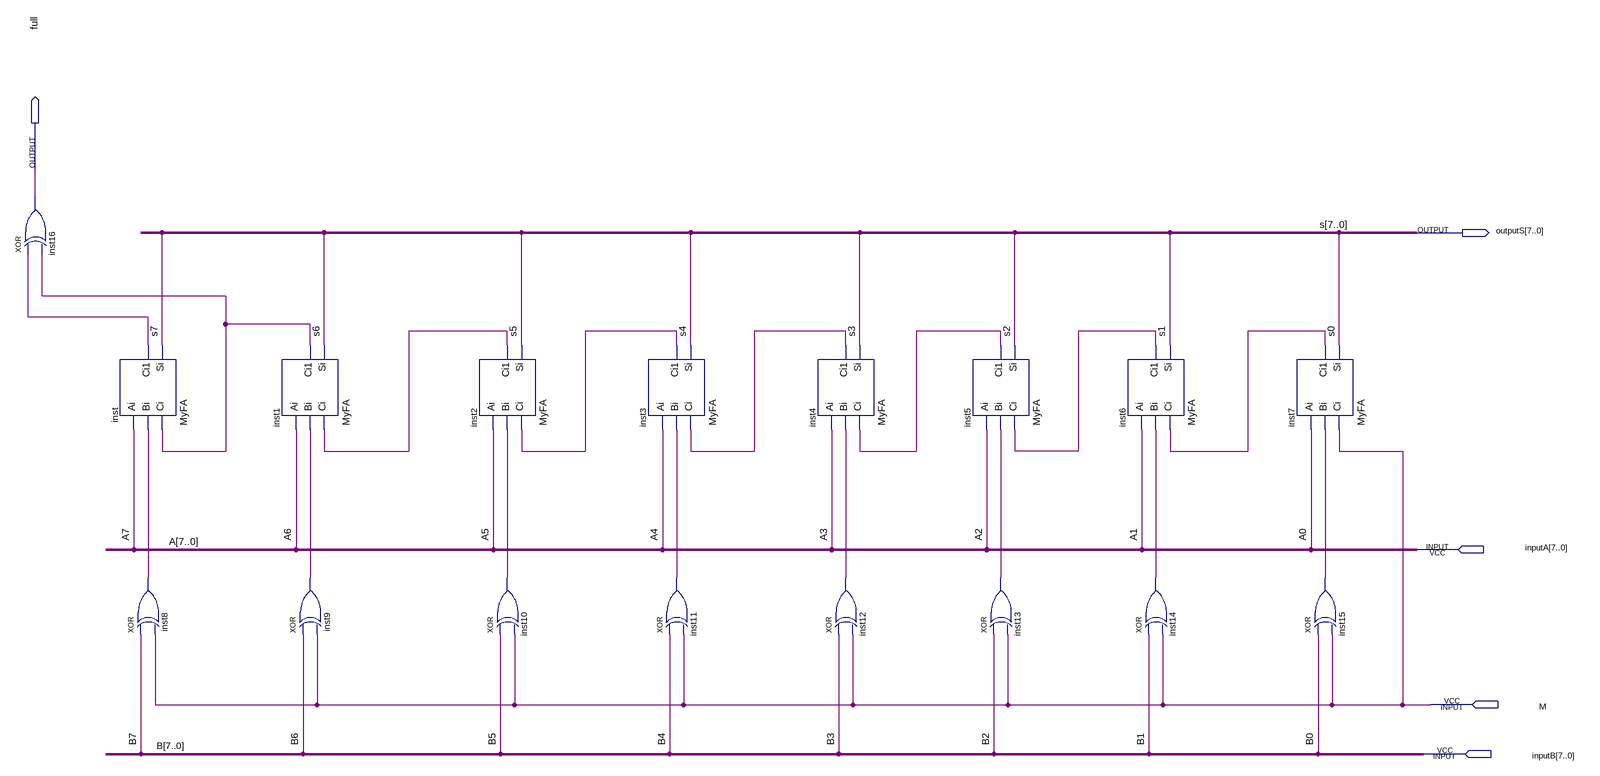
[diagram p0: schematic sheet]
// Quartus schematic MyALU.bdf as structural Verilog: 17 symbols, 5 pins
module MyALU (
  input  [7:0] inputA,
  input  M,
  input  [7:0] inputB,
  output full,
  output [7:0] outputS
);

  wire inst1_ci1, inst2_ci1, inst3_ci1, inst4_ci1, inst5_ci1, inst6_ci1, inst7_ci1, inst8_out, inst9_out,
       inst10_out, inst11_out, inst12_out, inst13_out, inst14_out, inst15_out, inst_ci1;

  xor inst16 (full, inst_ci1, inst1_ci1);
  MyFA inst (.Ci(inst1_ci1), .Bi(inst8_out), .Ai(inputA[7]), .Si(outputS[7]), .Ci1(inst_ci1));
  xor inst8 (inst8_out, inputB[7], M);
  MyFA inst1 (.Ci(inst2_ci1), .Bi(inst9_out), .Ai(inputA[6]), .Si(outputS[6]), .Ci1(inst1_ci1));
  xor inst9 (inst9_out, inputB[6], M);
  MyFA inst2 (.Ci(inst3_ci1), .Bi(inst10_out), .Ai(inputA[5]), .Si(outputS[5]), .Ci1(inst2_ci1));
  xor inst10 (inst10_out, inputB[5], M);
  MyFA inst3 (.Ci(inst4_ci1), .Bi(inst11_out), .Ai(inputA[4]), .Si(outputS[4]), .Ci1(inst3_ci1));
  xor inst11 (inst11_out, inputB[4], M);
  MyFA inst4 (.Ci(inst5_ci1), .Bi(inst12_out), .Ai(inputA[3]), .Si(outputS[3]), .Ci1(inst4_ci1));
  xor inst12 (inst12_out, inputB[3], M);
  MyFA inst5 (.Ci(inst6_ci1), .Bi(inst13_out), .Ai(inputA[2]), .Si(outputS[2]), .Ci1(inst5_ci1));
  xor inst13 (inst13_out, inputB[2], M);
  MyFA inst6 (.Ci(inst7_ci1), .Bi(inst14_out), .Ai(inputA[1]), .Si(outputS[1]), .Ci1(inst6_ci1));
  xor inst14 (inst14_out, inputB[1], M);
  MyFA inst7 (.Ci(M), .Bi(inst15_out), .Ai(inputA[0]), .Si(outputS[0]), .Ci1(inst7_ci1));
  xor inst15 (inst15_out, inputB[0], M);

  // Other names for the same wires on the sheet: A[7:0] = inputA; A0 = inputA[0]; A1 = inputA[1]; A2 = inputA[2];
  //   A3 = inputA[3]; A4 = inputA[4]; A5 = inputA[5]; A6 = inputA[6]; A7 = inputA[7]; B[7:0] = inputB; B0 = inputB[0];
  //   B1 = inputB[1]; B2 = inputB[2]; B3 = inputB[3]; B4 = inputB[4]; B5 = inputB[5]; B6 = inputB[6]; B7 = inputB[7];
  //   s[7:0] = outputS; s0 = outputS[0]; s1 = outputS[1]; s2 = outputS[2]; s3 = outputS[3]; s4 = outputS[4];
  //   s5 = outputS[5]; s6 = outputS[6]; s7 = outputS[7]
endmodule
